# EAGLE design shield100r1 (EAGLE 6.6.0)
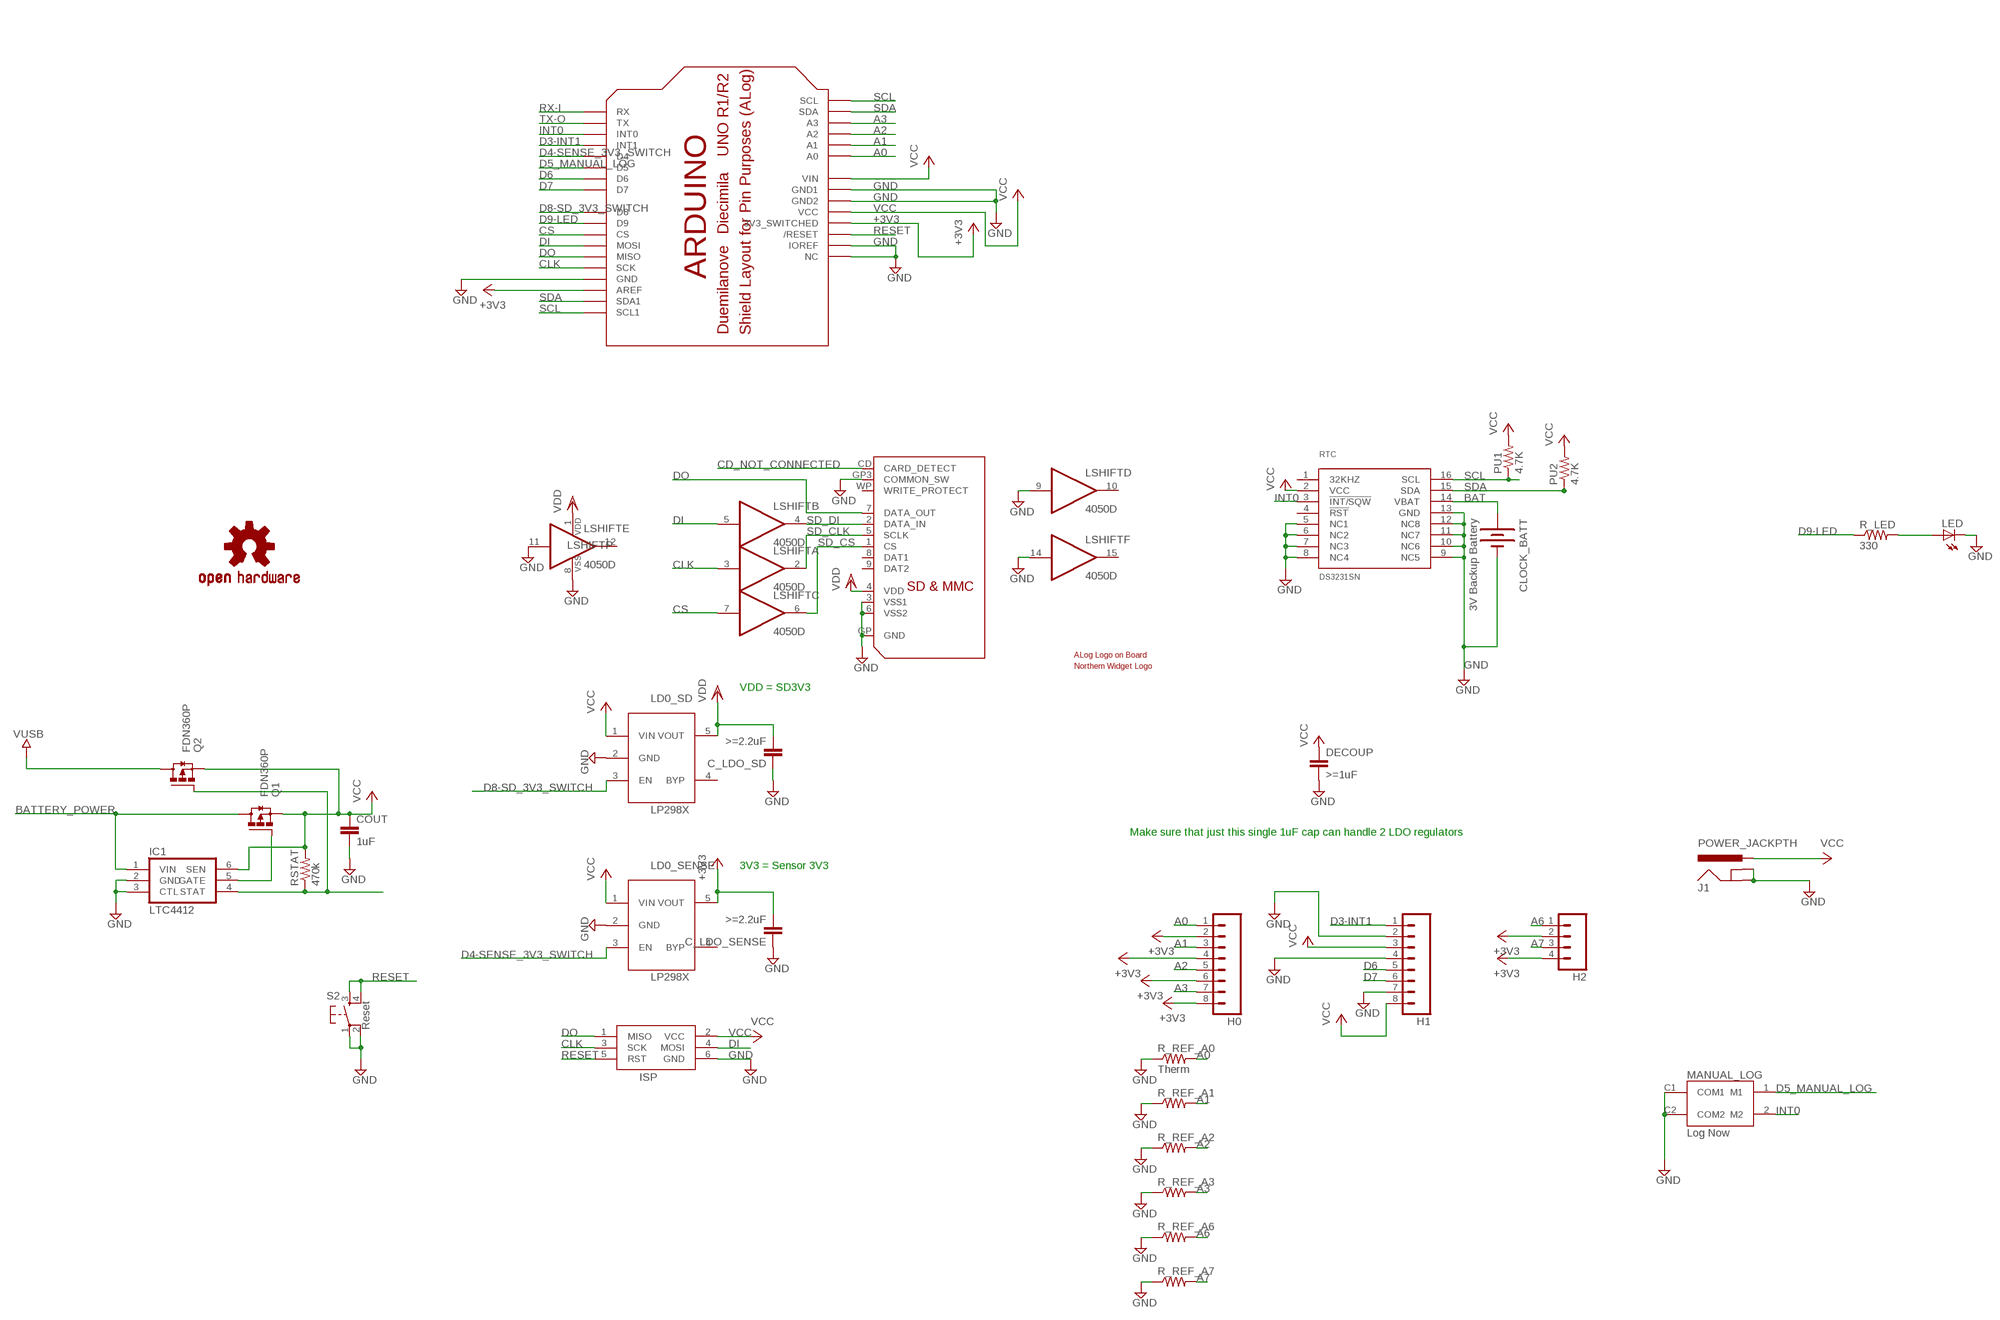
[diagram p0: schematic, sheet 1]

## Parts
C_LDO_SD  >=2.2uF  C-EUC0603  [C0603]
C_LDO_SENSE  >=2.2uF  C-EUC0603  [C0603]
CLOCK_BATT  3V Backup Battery  BATTERY12PTH  [BATTCON_12MM_PTH]
COUT  1uF  C-EUC0603  [C0603-ROUND]
DECOUP  >=1uF  C-EUC0603  [C0603]
H0  M083.5MM-8  [SCREWTERMINAL-3.5MM-8]
H1  M083.5MM-8  [SCREWTERMINAL-3.5MM-8]
H2  M04SCREW  [SCREWTERMINAL-3.5MM-4]
IC1  LTC4412  LTC4412ES6  [TSOT23-6]
ISP  AVRISP-6  [AVRISP]
J1  POWER_JACKPTH  [POWER_JACK_PTH]
LD0_SD  LP2985  LP298XS  [SOT23-5L]
LD0_SENSE  LP2985  LP298XS  [SOT23-5L]
LED  LED3MM  [LED3MM]
LOGO1  OSHW-LOGOM  [OSHW-LOGO-M]
LSHIFT  4050D  [SO16]
MANUAL_LOG  Log Now  TL3350'TL3350'  [TL_BUTTON]
PU1  4.7K  R-US_R0603  [R0603]
PU2  4.7K  R-US_R0603  [R0603]
Q1  FDN360P  [SUPER-SOT3]
Q2  FDN360P  [SUPER-SOT3]
R_LED  330  R-US_R0603  [R0603]
R_REF_A0  Therm  R-US_0207/10  [0207/10]
R_REF_A1  R-US_0207/10  [0207/10]
R_REF_A2  R-US_0207/10  [0207/10]
R_REF_A3  R-US_0207/10  [0207/10]
R_REF_A6  R-US_0207/10  [0207/10]
R_REF_A7  R-US_0207/10  [0207/10]
RSTAT  470k  R-US_R0603  [R0603]
RTC  DS3231SN  [SO16W]
S2  Reset  TAC_SWITCHSND  [TACTILE_SWITCH_SMD]
SD  SDMMC06132  [06132]
U$2  ALOG_LOGO_V1_5.5MM  [ALOG_LOGO_V1_SMALL]
U$3  NWLOGO_MED  [NWLOGO_MED]
U$9  ARDUINO_SHIELD_PIN_PURPOSE  [ARDUINO_SHIELD_PINS_ONLY]

## Nets
+3V3: C_LDO_SENSE.2 H0.2 H0.4 H0.6 H0.8 H2.2 H2.4 LD0_SENSE.5(VOUT) U$9.3.3V(3V3_SWITCHED) U$9.AREF
A0: H0.1 R_REF_A0.2 U$9.A0
A1: H0.3 R_REF_A1.2 U$9.A1
A2: H0.5 R_REF_A2.2 U$9.A2
A3: H0.7 R_REF_A3.2 U$9.A3
A6: H2.1 R_REF_A6.2
A7: H2.3 R_REF_A7.2
BAT: CLOCK_BATT.VCC@1(+) RTC.14(VBAT)
BATTERY_POWER: IC1.1(VIN) Q1.3(D)
CD_NOT_CONNECTED: SD.CD(CARD_DETECT)
CLK: ISP.3(SCK) LSHIFT.3(A:I) U$9.D13(SCK)
CS: LSHIFT.7(C:I) U$9.D10(CS)
D3-INT1: H1.1 U$9.D3(INT1)
D4-SENSE_3V3_SWITCH: LD0_SENSE.3(EN) U$9.D4
D5_MANUAL_LOG: MANUAL_LOG.1(M1) U$9.D5
D6: H1.5 U$9.D6
D7: H1.6 U$9.D7
D8-SD_3V3_SWITCH: LD0_SD.3(EN) U$9.D8
D9-LED: R_LED.1 U$9.D9
DI: ISP.4(MOSI) LSHIFT.5(B:I) U$9.D11(MOSI)
DO: ISP.1(MISO) SD.7(DATA_OUT) U$9.D12(MISO)
GND: C_LDO_SD.1 C_LDO_SENSE.1 CLOCK_BATT.GND(-) COUT.2 DECOUP.2 H1.2 H1.4 H1.7 IC1.2(GND) IC1.3(CTL) ISP.6(GND) J1.GND J1.GNDBREAK LD0_SD.2(GND) LD0_SENSE.2(GND) LED.K(C) LSHIFT.8(P:VSS) LSHIFT.9(D:I) LSHIFT.11(E:I) LSHIFT.14(F:I) MANUAL_LOG.C1(COM1) MANUAL_LOG.C2(COM2) R_REF_A0.1 R_REF_A1.1 R_REF_A2.1 R_REF_A3.1 R_REF_A6.1 R_REF_A7.1 RTC.5(NC1) RTC.6(NC2) RTC.7(NC3) RTC.8(NC4) RTC.9(NC5) RTC.10(NC6) RTC.11(NC7) RTC.12(NC8) RTC.13(GND) S2.1 S2.2 SD.3(VSS1) SD.6(VSS2) SD.GP3(COMMON_SW) SD.GP(GND) U$9.GND@0(GND) U$9.GND@1(GND1) U$9.GND@2(GND2) U$9.IOREF U$9.NC
INT0: MANUAL_LOG.2(M2) RTC.3(!INT/SQW) U$9.D2(INT0)
LED+: LED.A R_LED.2
N$7: IC1.4(STAT) Q2.1(G) RSTAT.1
N$8: IC1.5(GATE) Q1.1(G)
RESET: ISP.5(RST) S2.3 S2.4 U$9.RES(/RESET)
RX-I: U$9.RX
SCL: PU1.1 RTC.16(SCL) U$9.A5(SCL) U$9.SCL(SCL1)
SD_CLK: LSHIFT.2(A:O) SD.5(SCLK)
SD_CS: LSHIFT.6(C:O) SD.1(CS)
SD_DI: LSHIFT.4(B:O) SD.2(DATA_IN)
SDA: PU2.1 RTC.15(SDA) U$9.A4(SDA) U$9.SDA(SDA1)
TX-O: U$9.TX
VCC: COUT.1 DECOUP.1 H1.3 H1.8 IC1.6(SEN) ISP.2(VCC) J1.PWR LD0_SD.1(VIN) LD0_SENSE.1(VIN) PU1.2 PU2.2 Q1.2(S) Q2.2(S) RSTAT.2 RTC.2(VCC) U$9.5V(VCC) U$9.VIN
VDD: C_LDO_SD.2 LD0_SD.5(VOUT) LSHIFT.1(P:VDD) SD.4(VDD)
VUSB: Q2.3(D)
Unconnected: LD0_SD.4(BYP) LD0_SENSE.4(BYP) LSHIFT.10(D:O) LSHIFT.12(E:O) LSHIFT.15(F:O) RTC.1(32KHZ) RTC.4(!RST) SD.8(DAT1) SD.9(DAT2) SD.WP(WRITE_PROTECT)

## Notes on the sheet
- VDD = SD3V3
- Make sure that just this single 1uF cap can handle 2 LDO regulators
- 3V3 = Sensor 3V3

## Library data of the parts
C_LDO_SD C_LDO_SENSE DECOUP = resistor:C-EU: CAPACITOR, European symbol
CLOCK_BATT = SparkFun:BATTERY: Battery Holders Various common sizes : AA, AAA, 20mm coin cell and 12mm coin cell.
COUT = SmartPrj:C-EU: CAPACITOR, European symbol
H0 H1 = SparkFun:M08: Header 8 Standard 8-pin 0.1" header. Use with straight break away headers (SKU : PRT-00116), right angle break away headers (PRT-00553), swiss pins (PRT-00743), machine pins (PRT-00117), and female headers (PRT-00115).
H2 = SparkFun:M04: Header 4 Standard 4-pin 0.1" header. Use with straight break away headers (SKU : PRT-00116), right angle break away headers (PRT-00553), swiss pins (PRT-00743), machine pins (PRT-00117), and female headers (PRT-00115). Molex polarized connector foot print use with SKU : PRT-08231 with associated crimp pins and housings. 1MM SMD Version SKU: PRT-10208
IC1 = awickert:LTC4412*: Low Loss PowerPath Controller
ISP = adafruit:AVRISP: AVR ISP HEADER Standard 6 pin header for AVR programming
J1 = SparkFun:POWER_JACK: Power Jack This is the standard 5.5mm barrel jack for power. The PTH is the most common, proven, reliable, footprint. All others are experimental. The Slot footprint only works if the mill layer is transmitted to the PCB fab house so be warned. Spark Fun Electronics SKU : PRT-00119. Mating wall wart : TOL-00298 (and others)
LD0_SD LD0_SENSE = adafruit:LP298X
LED = SparkFun:LED: LEDs Standard schematic elements and footprints for 5mm, 3mm, 1206, and 0603 sized LEDs. 5mm - Spark Fun Electronics SKU : COM-00529 (and others)
LOGO1 = SparkFun-Aesthetics:OSHW-LOGO: Open Source Hardware Logo This logo indicates the piece of hardware it is found on incorporates a OSHW license and/or adheres to the definition of open source hardware found here: http://freedomdefined.org/OSHW
LSHIFT = 40xx:4050: Hex non-inverting BUFFER
MANUAL_LOG = awickert:TL3350: Dual action (half- and full-press) button: COM1 and COM2 are connected internally. Pin 1 connects to COM1 on a half-press, and both connect on a full press.
PU1 PU2 R_LED RSTAT = rcl:R-US_: RESISTOR, American symbol
Q1 Q2 = transistor-power:FDN360P: Single P-Channel, PowerTrench (R) MOSFET Source: http://www.fairchildsemi.com/ds/FD/FDN360P.pdf
R_REF_A0 R_REF_A1-R_REF_A3 R_REF_A6 R_REF_A7 = resistor:R-US_: RESISTOR, American symbol
RTC = comfile:DS3231SN
S2 = SparkFun:TAC_SWITCH: Momentary Switch Button commonly used for reset or general input. Spark Fun Electronics SKU : COM-00097
SD = adafruit:SDMMC: SD MMC Card holder 4UCON part #06132 - easy to solder
U$2 = awickert:ALOG_LOGO_V1_5.5MM
U$3 = awickert:NWLOGO_MED: Medium-sized Northern Widget logo
U$9 = awickert:ARDUINO_SHIELD_PIN_PURPOSE

## Net classes
1 power: width 0.254 mm

## Board
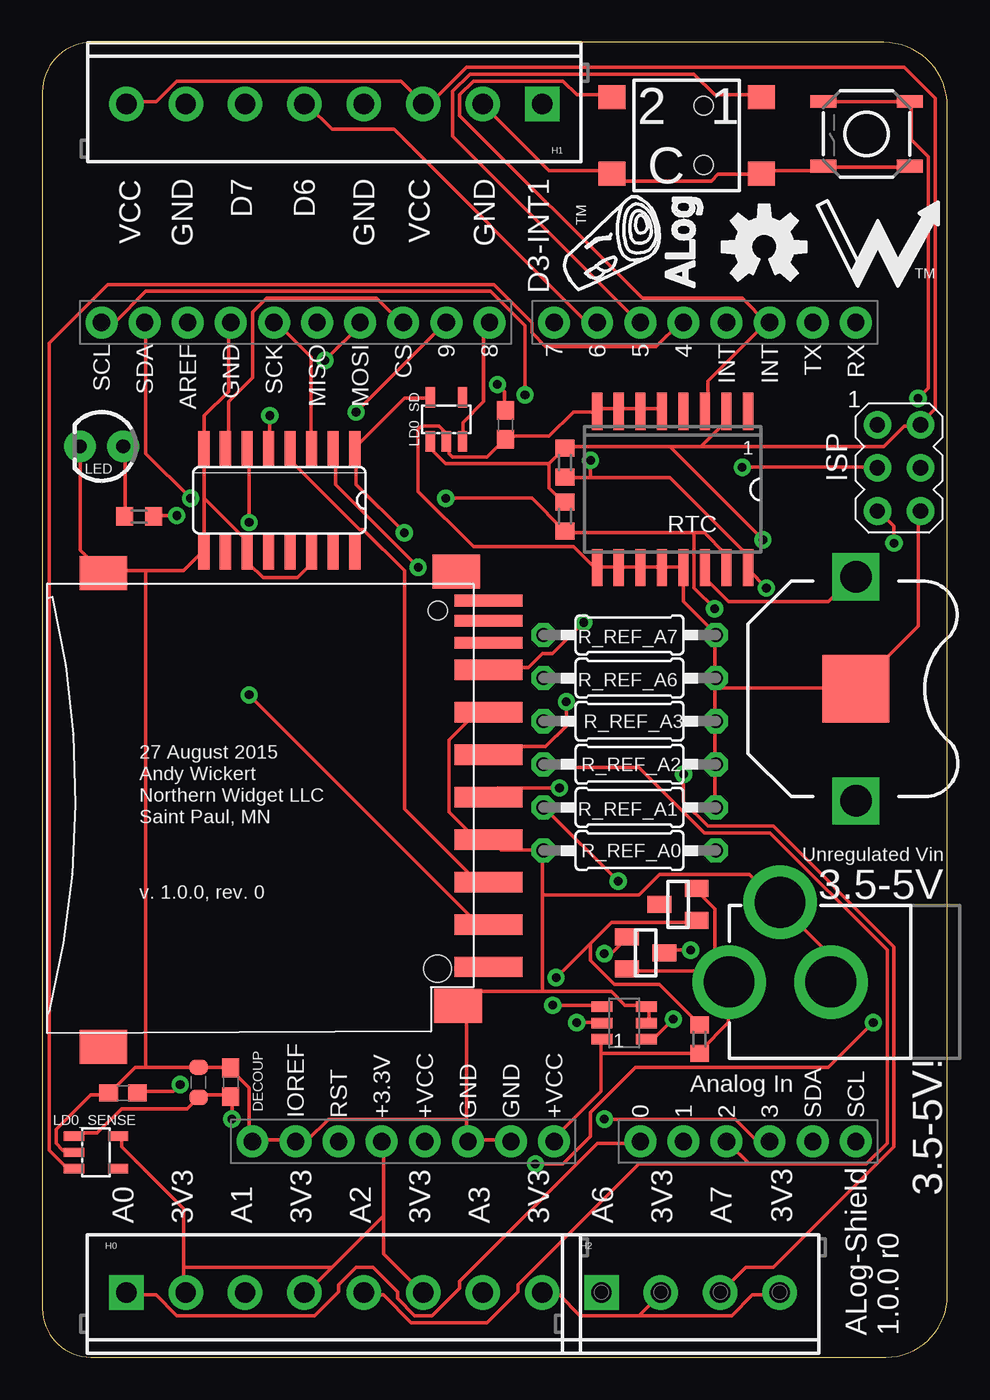
[diagram p1: board, top side]
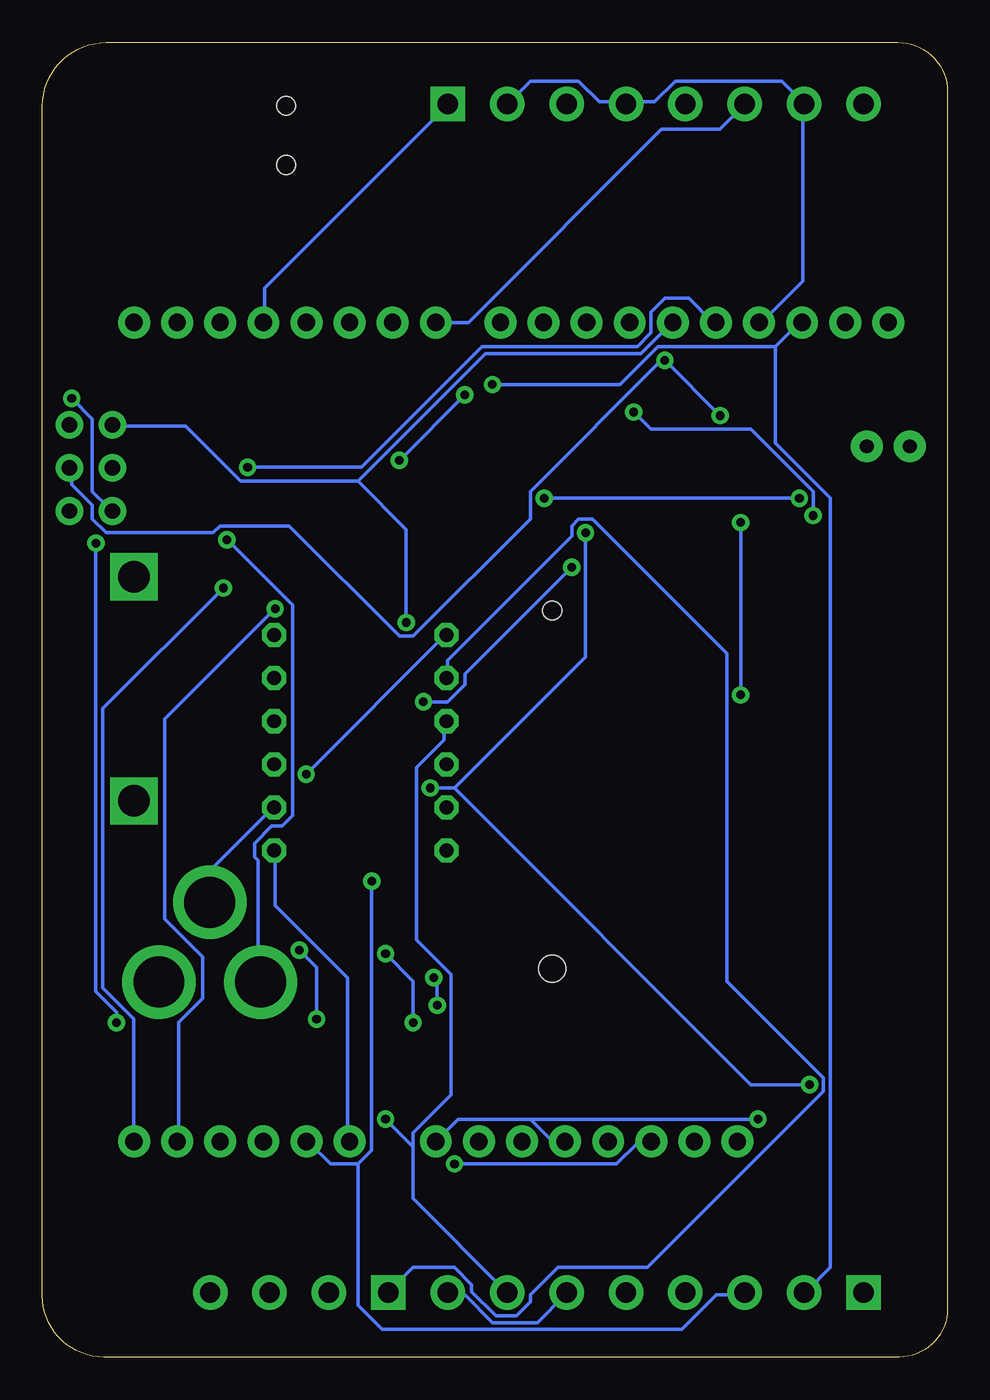
[diagram p2: board, bottom side, seen from below]

Size 53.33 x 77.46 mm. Coordinates in mm from the lower left corner, seen from the top.
Outline: 53.33,73.7 arc90 49.57,77.46 2.91,77.46 arc90 0,74.55 0,2.85 arc90 2.85,0 49.71,0 arc90 53.33,3.62 53.33,73.7
Copper layers (1*16): Top 0.035mm / dielectric 1.5mm / Bottom 0.035mm
Design rules "SparkFun": minimum track width 8mil, minimum drill 20mil, track to track 8mil, track to pad 8mil, pad to pad 8mil, via to via 8mil, smd to smd 8mil, copper to edge 10mil, drill to drill 8mil, minimum pad ring 12mil, minimum via ring 10mil, stop-mask expansion 4mil, vias tented up to drill 25mil, thermal gap 10mil

### Footprints (pad centres in the part's own frame; a part is rotated, then mirrored left to right if it is on the bottom)
C0603 = smd 1.1 x 1: 1 -0.85,0; 2 0.85,0
BATTCON_12MM_PTH = smd 3.962 x 3.962: GND 0,0 | drill 1.854 square: VCC@1 -6.604,0; VCC@2 6.604,0
C0603-ROUND = smd 0.898 x 1.1: 1 -0.889,0; 2 0.889,0
SCREWTERMINAL-3.5MM-8 = drill 1.2 pad 2.032 square: 1 0,0 | drill 1.2 pad 2.032: 2 3.5,0; 3 7,0; 4 10.5,0; 5 14,0; 6 17.5,0; 7 21,0; 8 24.5,0
SCREWTERMINAL-3.5MM-4 = drill 1.2 pad 2.032 square: 1 0,0 | drill 1.2 pad 2.032: 2 3.5,0; 3 7,0; 4 10.5,0
TSOT23-6 = smd 0.622 x 1.22: 1 -0.95,-1.31; 2 0,-1.31; 3 0.95,-1.31; 4 0.95,1.31; 5 0,1.31; 6 -0.95,1.31
AVRISP = drill 0.9 pad 1.626: 1 -1.27,2.54; 2 1.27,2.54; 3 -1.27,0; 4 1.27,0; 5 -1.27,-2.54; 6 1.27,-2.54
POWER_JACK_PTH = drill 2.997 pad 4.318: GND 0,7.7; GNDBREAK 4.7,10.7; PWR 0,13.7
SOT23-5L = smd 0.55 x 1.2: 1 -0.95,-1.3; 2 0,-1.3; 3 0.95,-1.3; 4 0.95,1.3; 5 -0.95,1.3
LED3MM = drill 0.813 pad 1.88: A -1.27,0; K 1.27,0
SO16 = smd 0.66 x 2.032: 1 -4.445,-3.073; 2 -3.175,-3.073; 3 -1.905,-3.073; 4 -0.635,-3.073; 5 0.635,-3.073; 6 1.905,-3.073; 7 3.175,-3.073; 8 4.445,-3.073; 9 4.445,3.073; 10 3.175,3.073; 11 1.905,3.073; 12 0.635,3.073; 13 -0.635,3.073; 14 -1.905,3.073; 15 -3.175,3.073; 16 -4.445,3.073
TL_BUTTON = smd 1.6 x 1.4: 1 0.8,0.7; 2 9.6,0.7; C1 0.8,5.2; C2 9.6,5.2 | hole 1.1: 4.2,1.2; 4.2,4.7
R0603 = smd 1 x 1.1: 1 -0.85,0; 2 0.85,0
SUPER-SOT3 = smd 1 x 1.4: 1 -0.95,-1.1; 2 0.95,-1.1; 3 0,1.1
0207/10 = drill 0.813 octagon: 1 -5.08,0; 2 5.08,0
SO16W = smd 0.6 x 2.2: 1 -4.445,-4.6; 2 -3.175,-4.6; 3 -1.905,-4.6; 4 -0.635,-4.6; 5 0.635,-4.6; 6 1.905,-4.6; 7 3.175,-4.6; 8 4.445,-4.6; 9 4.445,4.6; 10 3.175,4.6; 11 1.905,4.6; 12 0.635,4.6; 13 -0.635,4.6; 14 -1.905,4.6; 15 -3.175,4.6; 16 -4.445,4.6
TACTILE_SWITCH_SMD = smd 1.524 x 0.762: 1 -2.54,1.905; 2 2.54,1.905; 3 -2.54,-1.905; 4 2.54,-1.905
06132 = smd 1.2 x 4: 1 6.9,0.9; 2 4.4,0.9; 3 1.9,0.9; 4 -0.6,0.9; 5 -3.1,0.9; 6 -5.6,0.9; 7 -8.1,0.9; 9 9.4,0.9 | smd 0.7 x 4: 8 -9.7,0.9; CD -11,0.9; WP -12.2,0.9 | smd 2 x 2.8: GP -13.8,-21.8; GP2 14.1,-21.8; GP3 11.7,-0.9; GP4 -13.9,-1 | hole 1.1: -11.6,-2.1 | hole 1.6: 9.5,-2.1
ARDUINO_SHIELD_PINS_ONLY = drill 1.016 pad 1.88: 3.3V 50.8,26.67; 5V 50.8,29.21; A0 50.8,41.91; A1 50.8,44.45; A2 50.8,46.99; A3 50.8,49.53; A4 50.8,52.07; A5 50.8,54.61; AREF 2.54,15.24; D2 2.54,49.53; D3 2.54,46.99; D4 2.54,44.45; D5 2.54,41.91; D6 2.54,39.37; D7 2.54,36.83; D8 2.54,33.02; D9 2.54,30.48; D10 2.54,27.94; D11 2.54,25.4; D12 2.54,22.86; D13 2.54,20.32; GND@0 50.8,31.75; GND@1 50.8,34.29; GND@2 2.54,17.78; IOREF 50.8,21.59; NC 50.8,19.05; RES 50.8,24.13; RX 2.54,54.61; SCL 2.54,10.16; SDA 2.54,12.7; TX 2.54,52.07; VIN 50.8,36.83

### Placement (x,y rotation side)
C_LDO_SD  4.75,15.56 0 top
C_LDO_SENSE  27.29,54.93 90 top
CLOCK_BATT  47.93,39.37 270 top
COUT  9.2,16.19 90 top
DECOUP  11.1,16.19 90 top
H0  4.94,3.81 0 top
H1  29.44,73.83 180 top
H2  32.94,3.81 0 top
IC1  34.28,19.68 90 top
ISP  50.47,52.39 0 top
J1  54.17,22.1 90 top
LD0_SD  23.8,55.24 0 top
LD0_SENSE  3.17,12.06 270 top
LED  3.48,53.66 180 top
LOGO1  42.54,65.41 0 top
LSHIFT  13.96,50.48 180 top
MANUAL_LOG  43.17,74.93 180 top
PU1  30.79,52.7 90 top
PU2  30.79,49.53 90 top
Q1  35.55,23.81 270 top
Q2  37.46,26.67 90 top
R_LED  5.71,49.53 180 top
R_REF_A0  34.6,29.84 0 top
R_REF_A1  34.6,32.38 180 top
R_REF_A2  34.6,34.92 180 top
R_REF_A3  34.6,37.47 180 top
R_REF_A6  34.6,40.01 180 top
R_REF_A7  34.6,42.55 180 top
RSTAT  38.73,18.73 270 top
RTC  37.14,51.12 180 top
S2  48.57,72.07 180 top
SD  25.39,32.38 270 top
U$2  33.65,65.72 90 top
U$3  49.2,66.04 0 top
U$9  -6.68,63.5 270 top

### Tracks (layer width: path | path; a pad name or v marks a point on that pad's centre or on a via)
+3V3  (via drill 0.51)
  Top 0.203: v26.81,57.3 27.22,56.9 27.22,55.88 C_LDO_SENSE.2 | 35.14,2.44 31.69,2.44 30.47,3.66 29.45,3.66 H0.8 | 35.14,2.44 36.36,3.66 H2.2 | 35.14,2.44 40.63,2.44 41.85,3.66 43.27,3.66 H2.4 | 8.32,5.28 8.32,3.86 H0.2 | 8.32,5.28 8.32,8.74 4.66,12.39 4.66,13.01 LD0_SENSE.5 | 20.11,8.33 20.11,6.1 22.34,3.86 H0.6 | 20.11,8.33 20.11,12.6 U$9.3.3V | 20.11,8.33 17.06,5.28 | 17.06,5.28 15.64,3.86 H0.4 | 17.06,5.28 8.32,5.28
  Bottom 0.203: v26.81,57.3 19.29,57.3 17.06,59.54 10.15,59.54 | 10.15,59.54 8.73,60.96 U$9.AREF | H0.8 29.25,3.66 28.44,3.66 26.81,2.03 24.17,2.03 22.54,3.66 H0.6 | 10.15,59.54 10.15,53.85 6.9,50.6 6.9,5.28 8.32,3.86 H0.2
A0
  Top 0.203: H0.1 5.07,3.66 6.7,3.66 7.92,2.44 16.04,2.44 17.46,3.86 17.46,4.27 18.48,5.28 19.5,5.28 20.92,3.86 20.92,3.45 21.94,2.44 22.95,2.44 24.58,4.06 24.58,4.47 32.71,12.6 35.14,12.6 U$9.A0
  Bottom 0.203: R_REF_A0.2 39.61,29.67 39.61,26.62 35.35,22.35 35.35,12.8 U$9.A0
A1  (via drill 0.51)
  Top 0.203: v33.92,28.04 29.66,32.31 R_REF_A1.2
  Bottom 0.203: v33.92,28.04 33.92,12.19 34.74,11.38 | 34.74,11.38 36.36,11.38 37.58,12.6 U$9.A1 | 34.74,11.38 34.74,3.05 33.32,1.63 15.64,1.63 13.6,3.66 11.98,3.66 H0.3
A2
  Top 0.203: 41.65,11.38 48.55,11.38 49.77,12.6 49.77,23.98 42.87,30.89 39,30.89 35.14,34.75 29.66,34.75 R_REF_A2.2 | 41.65,11.38 40.43,12.6 U$9.A2 | 41.65,11.38 35.14,11.38 28.03,4.27 28.03,3.86 26.2,2.03 21.73,2.03 20.11,3.66 19.09,3.66 H0.5
A3  (via drill 0.51)
  Top 0.203: v33.11,14.02 40.83,14.02 42.05,12.8 42.66,12.8 U$9.A3
  Bottom 0.203: 31.49,12.39 31.49,9.35 26,3.86 H0.7 | 31.49,12.39 31.49,13.21 29.25,15.44 29.25,22.55 31.28,24.59 31.28,34.75 29.66,36.37 29.66,37.39 R_REF_A3.2 | 31.49,12.39 v33.11,14.02
A6
  Bottom 0.203: R_REF_A6.2 29.45,40.03 29.45,41.05 22.14,48.36 22.14,48.97 21.73,49.38 20.92,49.38 13,41.45 13,22.15 7.31,16.46 7.31,15.65 17.67,5.28 22.95,5.28 24.58,3.66 24.58,3.25 25.39,2.44 26.61,2.44 28.03,3.86 28.03,4.27 29.05,5.28 31.49,5.28 32.91,3.86 H2.1
A7  (via drill 0.51)
  Top 0.203: v37.79,34.34 37.79,32.72 39.21,31.29 43.07,31.29 50.18,24.18 50.18,12.39 43.07,5.28 41.44,5.28 40.02,3.86 H2.3
  Bottom 0.203: v37.79,34.34 29.66,42.47 R_REF_A7.2
BAT
  Top 0.203: RTC.14 39.21,46.33 39.21,45.72 40.43,44.5 46.32,44.5 47.74,45.92 CLOCK_BATT.VCC@1
BATTERY_POWER  (via drill 0.51)
  Top 0.203: v37.18,19.91 36.16,18.9 35.75,18.9 IC1.1 | v38.19,23.98 36.77,23.98 Q1.3
  Bottom 0.203: v37.18,19.91 37.18,22.96 v38.19,23.98
CLK  (via drill 0.51)
  Top 0.203: LSHIFT.3 15.84,53.65 15.84,58.93 13.81,60.96 U$9.D13 | v41.24,52.43 49.16,52.43 ISP.3
  Bottom 0.203: v41.24,52.43 34.53,52.43 27.42,59.54 18.28,59.54 17.46,60.35 17.46,61.57 16.65,62.38 15.23,62.38 13.81,60.96 U$9.D13
CS
  Top 0.203: LSHIFT.7 10.96,53.65 10.96,56.29 12.38,57.71 12.38,61.57 13.2,62.38 19.7,62.38 21.12,60.96 U$9.D10
D3-INT1
  Bottom 0.203: U$9.D3 40.22,60.96 40.22,62.99 29.45,73.76 H1.1
D4-SENSE_3V3_SWITCH
  Top 0.203: LD0_SENSE.3 1.82,11.18 1.41,11.18 0.4,12.19 0.4,59.74 3.85,63.2 26.61,63.2 28.84,60.96 28.84,60.35 29.66,59.54 36.16,59.54 37.58,60.96 U$9.D4
D5_MANUAL_LOG
  Top 0.203: MANUAL_LOG.1 42.26,74.37 39.61,74.37 38.4,75.59 25.19,75.59 24.17,74.57 24.17,71.93 35.14,60.96 U$9.D5
D6
  Top 0.203: U$9.D6 32.1,60.96 20.72,72.34 17.06,72.34 15.64,73.76 H1.5
D7
  Bottom 0.203: U$9.D7 28.23,60.96 16.86,72.34 13.4,72.34 11.98,73.76 H1.6
D8-SD_3V3_SWITCH
  Top 0.203: LD0_SD.3 24.78,54.05 24.78,55.07 26,56.29 26,60.76 26.2,60.96 U$9.D8
D9-LED  (via drill 0.51)
  Top 0.203: v7.92,49.58 6.7,49.58 R_LED.1 | v18.48,55.68 23.76,60.96 U$9.D9
  Bottom 0.203: v7.92,49.58 7.92,51 11.57,54.66 17.46,54.66 v18.48,55.68
DI  (via drill 0.51)
  Top 0.203: v13.4,55.47 13.4,53.65 LSHIFT.5 | v16.65,58.73 18.89,60.96 U$9.D11
  Bottom 0.203: v13.4,55.47 v16.65,58.73 16.86,58.73 24.58,51 24.58,49.38 31.49,42.47 32.3,42.47 38.8,48.97 42.87,48.97 43.27,48.56 49.57,48.56 50.38,49.38 50.38,50.19 51.6,51.41 51.6,52.22 ISP.4
DO  (via drill 0.51)
  Top 0.203: v31.89,43.28 30.06,41.45 29.45,41.45 28.64,40.64 26.41,40.64 SD.7
  Bottom 0.203: 34.74,51.61 41.65,51.61 44.9,54.86 49.16,54.86 ISP.1 | 34.74,51.61 27.22,59.13 18.07,59.13 16.25,60.96 U$9.D12 | v31.89,43.28 31.89,48.77 34.74,51.61
GND
  Top 0.203: S2.1 50.99,70.1 46.12,70.1 S2.2 45.91,70.1 45.71,69.9 42.46,69.9 MANUAL_LOG.C1 42.26,69.7 39.82,69.7 39.41,69.29 34.13,69.29 33.72,69.7 MANUAL_LOG.C2 33.52,69.9 29.86,69.9 26,73.76 H1.2 | 9.54,50.6 9.54,53.44 LSHIFT.8 9.54,53.65 9.54,55.47 10.96,56.9 10.96,60.96 U$9.GND@2 | 9.54,50.6 9.54,47.55 LSHIFT.9 9.34,47.35 8.32,46.33 6.09,46.33 | 9.54,50.6 11.98,48.16 11.98,47.55 LSHIFT.11 12.18,47.35 12.18,46.74 13,45.92 15.03,45.92 15.84,46.74 15.84,47.35 LSHIFT.14 | 6.09,46.33 3.65,46.33 SD.GP 3.44,46.33 2.23,47.55 2.23,53.65 LED.K | 6.09,17.07 9.13,17.07 COUT.2 9.34,17.07 10.96,17.07 DECOUP.2 11.17,16.87 12.18,15.85 12.18,12.8 U$9.NC 12.38,12.8 14.82,12.8 U$9.IOREF 15.03,12.8 15.64,12.8 16.86,14.02 24.98,14.02 | 6.09,17.07 5.48,17.07 4.05,15.65 C_LDO_SD.1 3.85,15.44 2.84,15.44 0.8,13.41 0.8,12.6 1.21,12.19 1.82,12.19 LD0_SENSE.2 | SD.6 26.2,37.8 25.39,37.8 23.97,36.37 23.97,32.11 25.39,30.68 26.2,30.68 SD.3 26.41,30.48 27.02,29.87 29.45,29.87 R_REF_A0.1 29.45,29.67 29.45,27.23 | U$9.GND@1 27.42,12.8 25.19,12.8 U$9.GND@0 24.98,12.8 24.98,14.02 | IC1.2 35.75,19.71 35.75,20.52 IC1.3 35.55,20.73 34.33,20.73 33.52,21.54 29.45,21.54 | 29.45,21.54 25.39,21.54 24.98,21.13 | 24.98,21.13 24.58,20.73 SD.GP3 24.98,21.13 | 24.98,21.13 24.98,14.02 | 29.45,21.54 29.45,27.23 | J1.GND 46.32,22.15 46.32,23.77 43.48,26.62 J1.GNDBREAK 43.27,26.82 41.65,28.45 36.36,28.45 35.14,27.23 29.45,27.23 | ISP.6 51.6,49.78 51.6,43.08 47.95,39.42 CLOCK_BATT.GND 47.74,39.42 39.61,39.42 | RTC.5 36.36,55.88 35.35,55.88 RTC.6 35.14,55.88 34.13,55.88 RTC.7 33.92,55.88 32.71,55.88 RTC.8 32.5,55.68 31.28,55.68 29.86,54.25 27.42,54.25 C_LDO_SENSE.1 27.22,54.05 26.2,53.03 24.17,53.03 23.97,53.24 23.97,53.85 LD0_SD.2 23.76,54.05 23.76,54.46 23.36,54.86 22.34,54.86 22.14,54.66 22.14,51 25.39,47.75 31.28,47.75 32.5,46.53 RTC.9 32.71,46.53 33.92,46.53 RTC.10 34.13,46.53 35.14,46.53 RTC.11 35.35,46.53 36.36,46.53 RTC.12 36.57,46.53 37.58,46.53 RTC.13 37.79,46.33 37.79,44.5 39.61,42.67 R_REF_A7.1 39.61,42.47 39.61,40.03 R_REF_A6.1
  Top 0.203: R_REF_A1.1 39.61,32.51 39.61,34.75 R_REF_A2.1 39.61,34.95 39.61,37.39 R_REF_A3.1 39.61,37.59 39.61,39.42 | 39.61,39.42 39.61,39.83 R_REF_A6.1 | 39.61,39.42 R_REF_A6.1 | 6.09,17.07 6.09,46.33
  Bottom 0.203: H1.2 25.8,73.97 24.58,75.18 21.73,75.18 20.51,73.97 19.09,73.97 H1.4 18.89,73.97 17.26,73.97 16.04,75.18 9.74,75.18 8.52,73.97 H1.7 8.52,73.76 8.52,63.4 10.96,60.96 U$9.GND@2 | J1.GNDBREAK 43.27,26.82 43.27,28.85 39.82,32.31 R_REF_A1.1
INT0
  Top 0.203: 42.66,60.96 41.24,62.38 35.35,62.38 24.58,73.15 24.58,74.37 25.39,75.18 30.67,75.18 31.49,74.37 33.52,74.37 MANUAL_LOG.2 | 42.66,60.96 39.21,57.51 39.21,55.88 RTC.3 | 42.66,60.96 U$9.D2
LED+
  Top 0.203: R_LED.2 4.87,49.58 4.87,53.65 LED.A
N$7  (via drill 0.51)
  Top 0.203: 32.3,24.38 32.3,23.37 33.72,21.95 36.36,21.95 38.6,19.71 RSTAT.1 | 32.3,24.38 33.52,25.6 38.4,25.6 Q2.1 | v30.06,20.73 32.91,20.73 IC1.4 | 32.3,24.38 v30.27,22.35
  Bottom 0.203: v30.06,20.73 30.06,22.15 v30.27,22.35
N$8  (via drill 0.51)
  Top 0.203: v31.49,19.71 32.91,19.71 IC1.5 | v33.11,23.77 33.52,23.77 34.33,24.59 Q1.1
  Bottom 0.203: v31.49,19.71 31.49,22.15 v33.11,23.77
RESET  (via drill 0.51)
  Top 0.203: S2.4 46.12,73.97 50.99,73.97 S2.3 51.2,73.97 51.2,71.73 52.21,70.71 52.21,57.1 v51.6,56.49 | v29.05,11.38 30.67,11.38 32.3,13.01 32.3,14.43 34.94,17.07 46.32,17.07 v48.96,19.71 | v50.18,47.95 50.18,48.97 49.37,49.78 ISP.5
  Bottom 0.203: v51.6,56.49 50.38,55.27 50.38,51 49.37,49.99 ISP.5 | v29.05,11.38 19.5,11.38 18.28,12.6 17.46,12.6 U$9.RES | v48.96,19.71 48.96,20.32 50.18,21.54 v50.18,47.95
SCL  (via drill 0.51)
  Top 0.203: 32.3,51.82 36.97,51.82 41.44,47.35 41.44,46.53 RTC.16 41.65,46.33 v42.66,45.31 | 32.3,51.82 30.88,51.82 PU1.1 | U$9.SCL 4.26,60.96 6.09,62.79 26.41,62.79 28.44,60.76 v28.44,56.69 | 32.3,51.82 v32.3,52.83
  Bottom 0.203: v42.66,45.31 49.77,38.2 49.77,21.74 47.95,19.91 47.95,12.8 U$9.A5 | v32.3,52.83 v28.44,56.69
SD_CLK  (via drill 0.51)
  Top 0.203: v22.14,46.53 17.26,51.41 17.26,53.44 LSHIFT.2 | v30.88,38.61 30.88,37.19 29.66,35.97 26.81,35.97 26.41,35.56 SD.5
  Bottom 0.203: v22.14,46.53 28.44,40.23 28.44,39.62 29.45,38.61 v30.88,38.61
SD_CS  (via drill 0.51)
  Top 0.203: v12.18,49.17 12.18,53.44 LSHIFT.6 | v12.18,39.01 25.59,25.6 26.2,25.6 SD.1
  Bottom 0.203: v12.18,39.01 v12.18,49.17
SD_DI
  Top 0.203: LSHIFT.4 14.62,53.44 14.62,52.83 18.68,48.77 18.89,48.77 21.33,46.33 21.33,32.31 25.59,28.04 26.2,28.04 SD.2
SDA  (via drill 0.51)
  Top 0.203: 38.4,48.56 39,48.56 40.22,47.35 40.22,46.53 RTC.15 | 38.4,48.56 30.88,48.56 PU2.1 30.67,48.77 28.84,50.6 v23.76,50.6 | v39.61,44.09 38.4,45.31 38.4,48.56 | v8.73,50.6 6.09,53.24 6.09,60.96 U$9.SDA
  Bottom 0.203: v39.61,44.09 46.12,37.59 46.12,25.81 43.88,23.57 43.88,21.13 45.3,19.71 45.3,12.8 U$9.A4 | v23.76,50.6 v8.73,50.6
VCC  (via drill 0.51)
  Top 0.203: J1.PWR 40.43,21.95 40.43,19.71 38.8,18.09 RSTAT.2 38.6,17.88 32.91,17.88 | 39.61,22.76 39.82,22.76 40.43,22.15 J1.PWR | 39.61,22.76 34.53,22.76 Q1.2 | 39.61,22.76 39.61,26.42 38.6,27.43 Q2.2 | 39.61,22.76 J1.PWR | LD0_SENSE.1 2.02,13.21 3.24,13.21 4.66,14.63 8.52,14.63 COUT.1 9.34,15.44 10.96,15.44 DECOUP.1 11.17,15.24 v11.17,14.02 | 32.91,17.88 32.91,15.65 30.06,12.8 U$9.VIN | 32.91,17.88 32.91,18.69 IC1.6 | H1.8 5.07,73.97 6.7,73.97 7.92,75.18 21.12,75.18 22.34,73.97 H1.3 22.54,73.97 22.95,73.97 24.98,76 50.79,76 52.62,74.17 52.62,55.88 51.81,55.07 ISP.2 51.6,54.86 50.79,54.86 49.57,53.65 38.8,53.65 | 29.86,52.63 29.86,51.21 30.67,50.39 PU2.2 | 29.86,52.63 30.67,53.44 PU1.2 30.88,53.65 36.97,53.65 | 29.86,52.63 23.76,52.63 22.95,53.44 22.95,53.85 LD0_SD.1 | 38.8,53.65 40.22,55.07 40.22,55.68 RTC.2 | 36.97,53.65 38.8,53.65 | 36.97,53.65 v42.46,48.16
  Bottom 0.203: 24.58,14.02 23.36,12.8 22.54,12.8 U$9.5V | 24.58,14.02 28.84,14.02 30.06,12.8 U$9.VIN | 24.58,14.02 v11.17,14.02 | v42.46,48.16 38.6,44.3 38.6,31.9 39.21,31.29 39.82,31.29 40.83,30.28 40.83,29.46 40.63,29.26 40.63,22.15 J1.PWR
VDD  (via drill 0.51)
  Top 0.203: LD0_SD.5 22.75,56.49 21.33,56.49 18.48,53.65 LSHIFT.1 18.48,53.44 18.48,51.41 v21.33,48.56 | v8.12,16.05 7.71,15.65 5.68,15.65 C_LDO_SD.2 | v30.47,33.53 26.81,33.53 26.41,33.12 SD.4
  Bottom 0.203: v8.12,16.05 11.57,16.05 29.05,33.53 | v30.47,33.53 29.05,33.53 | v21.33,48.56 21.33,41.25 29.05,33.53

### Text on the board
tPlace: VCC | GND | D7 | D6 | GND | VCC | GND | D3-INT1 | TM | TM | 1 | 27 August 2015 | Andy Wickert | Northern Widget LLC | Saint Paul, MN | Unregulated Vin | v. 1.0.0, rev. 0 | 3.5-5V | 1 | 3.5-5V! | A0 | 3V3 | A1 | 3V3 | A2 | 3V3 | A3 | 3V3 | A6 | 3V3 | A7 | 3V3 | ALog-Shield / 1.0.0 r0